# Altium schematic sheet USB_HUB.SchDoc: Dahlia Carrier Board
size A3; Organization: Toradex AG; Address1: Ebenaustrasse 10; Address2: Horw; Address3: 6048; Address4: Switzerland; DocumentNumber: 5; Revision: V1.1; SheetNumber: 5; SheetTotal: 21; PageSetup: Record=PageOptions|CenterHorizontal=True|CenterVertical=True|PrintScale=0.71|XCorrection=1.00|YCorrection=1.00|PrintKind=1|BorderSize=5000000|LeftOffset=0|BottomOffset=0|Orientation=2|PaperLength=1000|PaperWidth=1000|Scale=100|PaperSource=15|PrintQuality=600|MediaType=1|DitherType=10|PaperKind=A4|PrintScaleMode=1
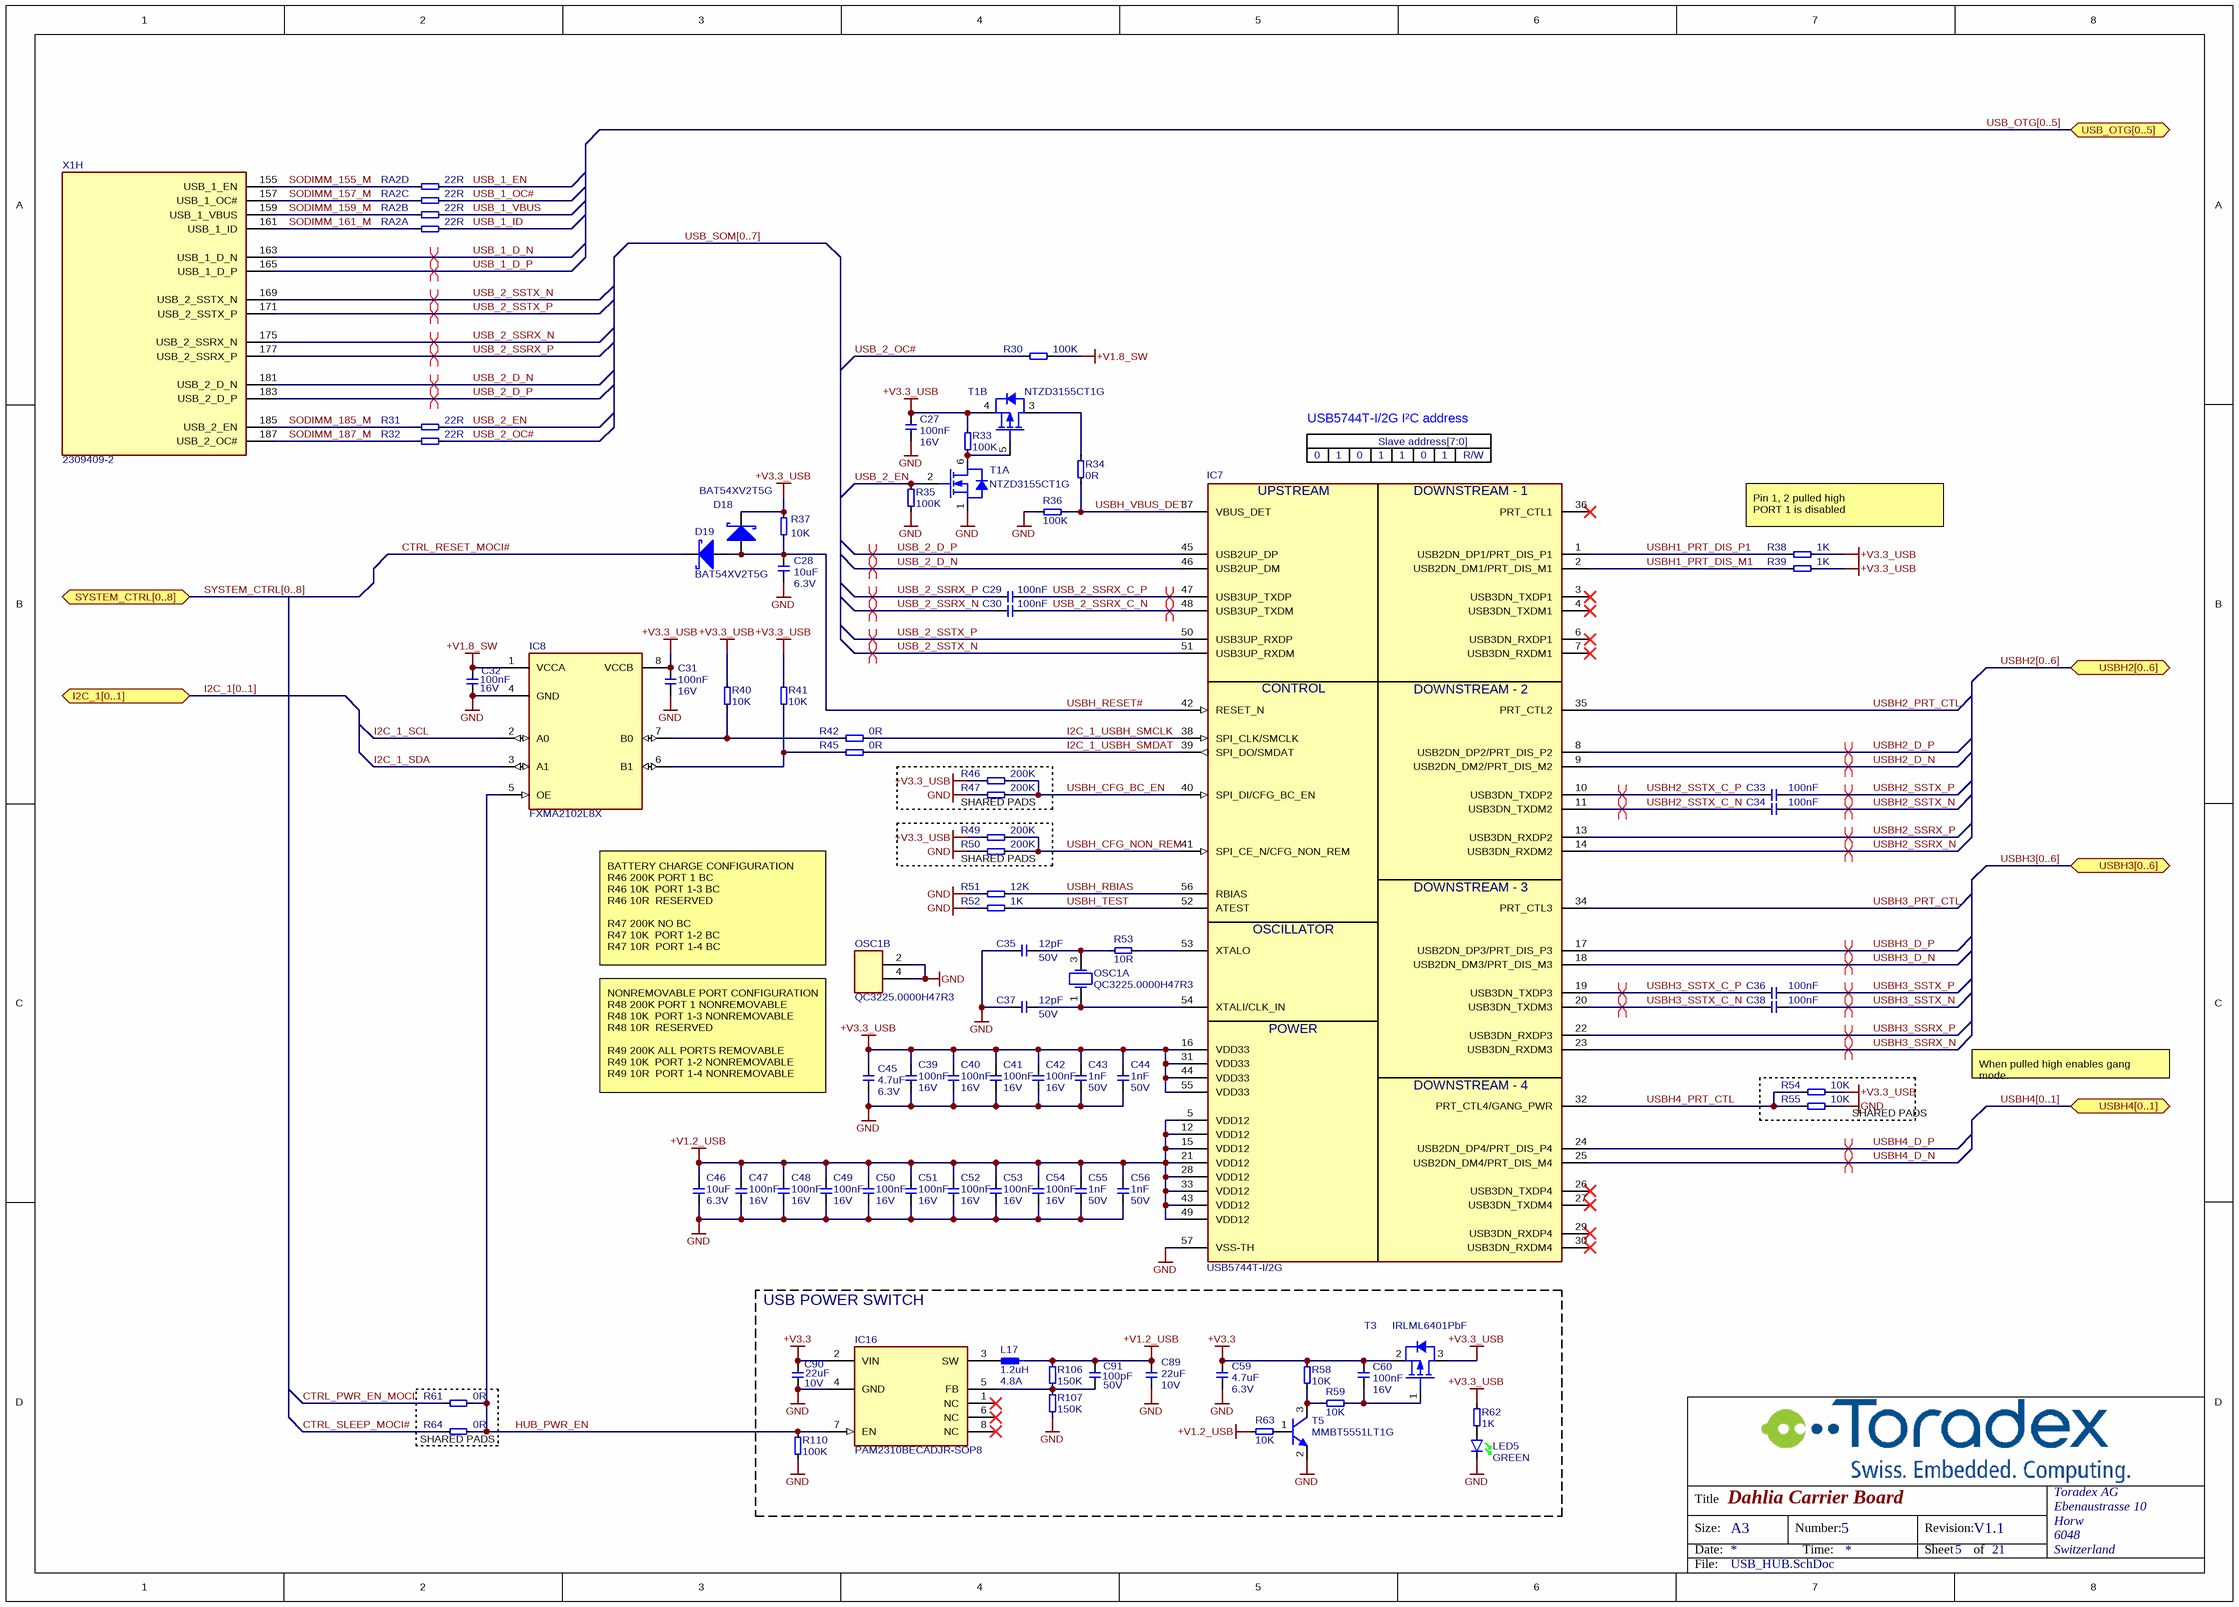
[diagram p0: USB_HUB.SchDoc]

## Parts
C27  Rating: 16V  [CAPC1005X60N]  (hidden comment: 100nF)
C28  Rating: 6.3V  [CAPC1005X60N]  (hidden comment: 10uF)
C29  100nF  [CAPC1005X60N]
C30  100nF  [CAPC1005X60N]
C31  Rating: 16V  [CAPC1005X60N]  (hidden comment: 100nF)
C32  Rating: 16V  [CAPC1005X60N]  (hidden comment: 100nF)
C33  100nF  [CAPC1005X60N]
C34  100nF  [CAPC1005X60N]
C35  Rating: 50V  [CAPC1005X60N]  (hidden comment: 12pF)
C36  100nF  [CAPC1005X60N]
C37  Rating: 50V  [CAPC1005X60N]  (hidden comment: 12pF)
C38  100nF  [CAPC1005X60N]
C39  Rating: 16V  [CAPC1005X60N]  (hidden comment: 100nF)
C40  Rating: 16V  [CAPC1005X60N]  (hidden comment: 100nF)
C41  Rating: 16V  [CAPC1005X60N]  (hidden comment: 100nF)
C42  Rating: 16V  [CAPC1005X60N]  (hidden comment: 100nF)
C43  Rating: 50V  [CAPC1005X60N]  (hidden comment: 1nF)
C44  Rating: 50V  [CAPC1005X60N]  (hidden comment: 1nF)
C45  Rating: 6.3V  [CAPC1005X60N]  (hidden comment: 4.7uF)
C46  Rating: 6.3V  [CAPC1005X60N]  (hidden comment: 10uF)
C47  Rating: 16V  [CAPC1005X60N]  (hidden comment: 100nF)
C48  Rating: 16V  [CAPC1005X60N]  (hidden comment: 100nF)
C49  Rating: 16V  [CAPC1005X60N]  (hidden comment: 100nF)
C50  Rating: 16V  [CAPC1005X60N]  (hidden comment: 100nF)
C51  Rating: 16V  [CAPC1005X60N]  (hidden comment: 100nF)
C52  Rating: 16V  [CAPC1005X60N]  (hidden comment: 100nF)
C53  Rating: 16V  [CAPC1005X60N]  (hidden comment: 100nF)
C54  Rating: 16V  [CAPC1005X60N]  (hidden comment: 100nF)
C55  Rating: 50V  [CAPC1005X60N]  (hidden comment: 1nF)
C56  Rating: 50V  [CAPC1005X60N]  (hidden comment: 1nF)
C59  Rating: 6.3V  [CAPC1005X60N]  (hidden comment: 4.7uF)
C60  Rating: 16V  [CAPC1005X60N]  (hidden comment: 100nF)
C89  Rating: 10V  [T_CAPC0805X125N]  (hidden comment: 22uF)
C90  Rating: 10V  [T_CAPC0805X125N]  (hidden comment: 22uF)
C91  Rating: 50V  [CAPC1005X60N]  (hidden comment: 100pF)
D18  BAT54XV2T5G  [SOD-523]
D19  BAT54XV2T5G  [SOD-523]
IC7  USB5744T-I/2G  [IC-QFN40P700X700X100_HS-57N]
IC8  FXMA2102L8X  [IC-MicroPak50P160X2160X55-8N]
IC16  Manufacturer Part No.: PAM2310BECADJR-SOP8  [IC-SO-8EP]  (hidden comment: PAM2310BECADJR)
L17  Rating: 4.8A  [IND-BOURNS-SRP4020TA]  (hidden comment: 1.2uH)
LED5  Color: GREEN  [T_Liteon_LTST-C190GKT]  (hidden comment: LTST-C190GKT)
OSC1  QC3225.0000H47R3  [OSC-SMD-3.2mmx2.5mm]  (parts A,B of 2)
R30  100K  [RESC1005X40N]
R31  22R  [RESC1005X40N]
R32  22R  [RESC1005X40N]
R33  100K  [RESC1005X40N]
R34  0R  [T_RESC0603X30N]
R35  100K  [RESC1005X40N]
R36  100K  [RESC1005X40N]
R37  10K  [RESC1005X40N]
R38  1K  [RESC1005X40N]
R39  1K  [RESC1005X40N]
R40  10K  [RESC1005X40N]
R41  10K  [RESC1005X40N]
R42  0R  [T_RESC0603X30N]
R45  0R  [T_RESC0603X30N]
R46  200K  [T_RESC0603X30N]
R47  200K  [T_RESC0603X30N]
R49  200K  [T_RESC0603X30N]
R50  200K  [T_RESC0603X30N]
R51  12K  [RESC1005X40N]
R52  1K  [RESC1005X40N]
R53  10R  [RESC1005X40N]
R54  10K  [T_RESC0603X30N]
R55  10K  [T_RESC0603X30N]
R58  10K  [RESC1005X40N]
R59  10K  [RESC1005X40N]
R61  0R  [T_RESC0603X30N]
R62  1K  [RESC1005X40N]
R63  10K  [RESC1005X40N]
R64  0R  [T_RESC0603X30N]
R106  150K  [RESC1005X40N]
R107  150K  [RESC1005X40N]
R110  100K  [RESC1005X40N]
RA2  22R  [T_Resistor_Array_X4]  (parts A,B,C,D of 4)
T1  NTZD3155CT1G  [SOTFL50P160X60-6N]  (parts A,B of 2)
T3  IRLML6401PbF  [SOT95P237X112-3N]
T5  MMBT5551LT1G  [ONSC-SOT-23-3-318-08_V]
X1  2309409-2  [CON-TE-2309409-2-SOLDERABLE-STANDOFFS]  (part H of 23)

## Blocks framed on the sheet
SHARED PADS: R46 R47
SHARED PADS: R54 R55
USB POWER SWITCH: C59 C60 C89-C91 IC16 L17 LED5 R58 R59 R62 R63 R106 R107 R110 T3 T5
SHARED PADS: R61 R64

## Ports
I2C_1[0..1] (bidir), SYSTEM_CTRL[0..8] (bidir), USB_OTG[0..5] (bidir), USBH2[0..6] (bidir), USBH3[0..6] (bidir), USBH4[0..1] (bidir)

## Nets
+V1.2_USB: C46.2 C47.2 C48.2 C49.2 C50.2 C51.2 C52.2 C53.2 C54.2 C55.2 C56.2 C89.2 C91.2 IC7.5(VDD12) IC7.12(VDD12) IC7.15(VDD12) IC7.21(VDD12) IC7.28(VDD12) IC7.33(VDD12) IC7.43(VDD12) IC7.49(VDD12) L17.2 R63.2 R106.2
+V1.8_SW: C32.2 IC8.1(VCCA) R30.2
+V3.3: C59.2 C60.2 C90.2 IC16.2(VIN) R58.2 T3.2(S)
+V3.3_USB: C27.2 C31.2 C39.2 C40.2 C41.2 C42.2 C43.2 C44.2 C45.2 D18.C IC7.16(VDD33) IC7.31(VDD33) IC7.44(VDD33) IC7.55(VDD33) IC8.8(VCCB) R33.2 R37.2 R38.2 R39.2 R40.2 R41.2 R46.1 R49.1 R54.2 R62.2 T1.4(S) T3.3(D)
GND: C27.1 C28.1 C31.1 C32.1 C35.2 C37.2 C39.1 C40.1 C41.1 C42.1 C43.1 C44.1 C45.1 C46.1 C47.1 C48.1 C49.1 C50.1 C51.1 C52.1 C53.1 C54.1 C55.1 C56.1 C59.1 C89.1 C90.1 IC7.57(VSS-TH) IC8.4(GND) IC16.4(GND) LED5.K OSC1.2(OSC2) OSC1.4(OSC3) R35.1 R36.2 R47.1 R50.1 R51.1 R52.1 R55.2 R107.1 R110.1 T1.1(S) T5.2(E)
CTRL_PWR_EN_MOCI: R61.1
CTRL_RESET_MOCI#: D19.C
CTRL_SLEEP_MOCI#: R64.1
HUB_PWR_EN: IC8.5(OE) IC16.7(EN) R61.2 R64.2 R110.2
I2C_1_SCL: IC8.2(A0)
I2C_1_SDA: IC8.3(A1)
I2C_1_USBH_SMCLK: IC7.38(SPI_CLK/SMCLK) R42.2
I2C_1_USBH_SMDAT: IC7.39(SPI_DO/SMDAT) R45.2
SODIMM_155_M: RA2.4 X1.155(USB_1_EN)
SODIMM_157_M: RA2.3 X1.157(USB_1_OC#)
SODIMM_159_M: RA2.2 X1.159(USB_1_VBUS)
SODIMM_161_M: RA2.1 X1.161(USB_1_ID)
SODIMM_185_M: R31.1 X1.185(USB_2_EN)
SODIMM_187_M: R32.1 X1.187(USB_2_OC#)
USB_1_D_N: X1.163(USB_1_D_N)
USB_1_D_P: X1.165(USB_1_D_P)
USB_1_EN: RA2.8
USB_1_ID: RA2.5
USB_1_OC#: RA2.7
USB_1_VBUS: RA2.6
USB_2_D_N: IC7.46(USB2UP_DM) X1.181(USB_2_D_N)
USB_2_D_P: IC7.45(USB2UP_DP) X1.183(USB_2_D_P)
USB_2_EN: R31.2 R35.2 T1.2(G)
USB_2_OC#: R30.1 R32.2
USB_2_SSRX_C_N: C30.1 IC7.48(USB3UP_TXDM)
USB_2_SSRX_C_P: C29.1 IC7.47(USB3UP_TXDP)
USB_2_SSRX_N: C30.2 X1.175(USB_2_SSRX_N)
USB_2_SSRX_P: C29.2 X1.177(USB_2_SSRX_P)
USB_2_SSTX_N: IC7.51(USB3UP_RXDM) X1.169(USB_2_SSTX_N)
USB_2_SSTX_P: IC7.50(USB3UP_RXDP) X1.171(USB_2_SSTX_P)
USBH1_PRT_DIS_M1: IC7.2(USB2DN_DM1/PRT_DIS_M1) R39.1
USBH1_PRT_DIS_P1: IC7.1(USB2DN_DP1/PRT_DIS_P1) R38.1
USBH2_D_N: IC7.9(USB2DN_DM2/PRT_DIS_M2)
USBH2_D_P: IC7.8(USB2DN_DP2/PRT_DIS_P2)
USBH2_PRT_CTL: IC7.35(PRT_CTL2)
USBH2_SSRX_N: IC7.14(USB3DN_RXDM2)
USBH2_SSRX_P: IC7.13(USB3DN_RXDP2)
USBH2_SSTX_C_N: C34.2 IC7.11(USB3DN_TXDM2)
USBH2_SSTX_C_P: C33.2 IC7.10(USB3DN_TXDP2)
USBH2_SSTX_N: C34.1
USBH2_SSTX_P: C33.1
USBH3_D_N: IC7.18(USB2DN_DM3/PRT_DIS_M3)
USBH3_D_P: IC7.17(USB2DN_DP3/PRT_DIS_P3)
USBH3_PRT_CTL: IC7.34(PRT_CTL3)
USBH3_SSRX_N: IC7.23(USB3DN_RXDM3)
USBH3_SSRX_P: IC7.22(USB3DN_RXDP3)
USBH3_SSTX_C_N: C38.2 IC7.20(USB3DN_TXDM3)
USBH3_SSTX_C_P: C36.2 IC7.19(USB3DN_TXDP3)
USBH3_SSTX_N: C38.1
USBH3_SSTX_P: C36.1
USBH4_D_N: IC7.25(USB2DN_DM4/PRT_DIS_M4)
USBH4_D_P: IC7.24(USB2DN_DP4/PRT_DIS_P4)
USBH4_PRT_CTL: IC7.32(PRT_CTL4/GANG_PWR) R54.1 R55.1
USBH_CFG_BC_EN: IC7.40(SPI_DI/CFG_BC_EN) R46.2 R47.2
USBH_CFG_NON_REM: IC7.41(SPI_CE_N/CFG_NON_REM) R49.2 R50.2
USBH_RBIAS: IC7.56(RBIAS) R51.2
USBH_RESET#: C28.2 D18.A D19.A IC7.42(RESET_N) R37.1
USBH_TEST: IC7.52(ATEST) R52.2
USBH_VBUS_DET: IC7.37(VBUS_DET) R34.2 R36.1
NetC35_1: C35.1 OSC1.3(OSC2) R53.1
NetC37_1: C37.1 IC7.54(XTALI/CLK_IN) OSC1.1(OSC1)
NetC60_1: C60.1 R59.1 T3.1(G)
NetC91_1: C91.1 IC16.5(FB) R106.1 R107.2
NetIC7_53: IC7.53(XTALO) R53.2
NetIC8_6: IC8.6(B1) R41.1 R45.1
NetIC8_7: IC8.7(B0) R40.1 R42.1
NetIC16_3: IC16.3(SW) L17.1
NetLED5_A: LED5.A R62.1
NetR33_1: R33.1 T1.5(G) T1.6(D)
NetR34_1: R34.1 T1.3(D)
NetR58_1: R58.1 R59.2 T5.3(C)
NetR63_1: R63.1 T5.1(B)

Not connected (* = marked no-connect by the designer): IC7 3(USB3DN_TXDP1)* 4(USB3DN_TXDM1)* 6(USB3DN_RXDP1)* 7(USB3DN_RXDM1)* 26(USB3DN_TXDP4)* 27(USB3DN_TXDM4)* 29(USB3DN_RXDP4)* 30(USB3DN_RXDM4)* 36(PRT_CTL1)*; IC16 1(NC)* 6(NC)* 8(NC)*

## Buses and harness runs
bus I2C_1[0..1] = port I2C_1[0..1]
bus SYSTEM_CTRL[0..8] = port SYSTEM_CTRL[0..8]
bus USB_OTG[0..5] = port USB_OTG[0..5]
bus USB_SOM[0..7]
bus USBH2[0..6] = port USBH2[0..6]
bus USBH3[0..6] = port USBH3[0..6]
bus USBH4[0..1] = port USBH4[0..1]

## Layout directives
differential pair; differential pair class USB: USB_1_D_N, USB_1_D_P, USB_2_D_N, USB_2_D_P, USB_2_SSRX_C_N, USB_2_SSRX_C_P, USB_2_SSRX_N, USB_2_SSRX_P, USB_2_SSTX_N, USB_2_SSTX_P, USBH2_D_N, USBH2_D_P, USBH2_SSRX_N, USBH2_SSRX_P, USBH2_SSTX_C_N, USBH2_SSTX_C_P, USBH2_SSTX_N, USBH2_SSTX_P, USBH3_D_N, USBH3_D_P, USBH3_SSRX_N, USBH3_SSRX_P, USBH3_SSTX_C_N, USBH3_SSTX_C_P, USBH3_SSTX_N, USBH3_SSTX_P, USBH4_D_N, USBH4_D_P

## Notes on the sheet
- USB5744T-I/2G I²C address
- (near IC7) 0
- (near IC7) 1
- Slave address[7:0]
- (near IC7) R/W
- Pin 1, 2 pulled high
  PORT 1 is disabled
- (near R50) SHARED PADS
- BATTERY CHARGE CONFIGURATION
  R46 200K PORT 1 BC
  R46 10K  PORT 1-3 BC
  R46 10R  RESERVED
  R47 200K NO BC
  R47 10K  PORT 1-2 BC
  R47 10R  PORT 1-4 BC
- NONREMOVABLE PORT CONFIGURATION
  R48 200K PORT 1 NONREMOVABLE
  R48 10K  PORT 1-3 NONREMOVABLE
  R48 10R  RESERVED
  R49 200K ALL PORTS REMOVABLE
  R49 10K  PORT 1-2 NONREMOVABLE
  R49 10R  PORT 1-4 NONREMOVABLE
- When pulled high enables gang mode.
- Title
- Size:
- Date:
- A3
- Number:
- Time:
- Revision:
- Sheet
- of
- File:
- (in symbol IC-Microchip-USB5744T-I/2G) UPSTREAM; DOWNSTREAM - 1; CONTROL; DOWNSTREAM - 2; DOWNSTREAM - 3; OSCILLATOR; POWER; DOWNSTREAM - 4

## Library data of the parts
C27 C29-C34 C36 C38-C42 C47-C54 C60 = C-X7R-100nF-16V-10%-0402: Capacitor Ceramic X7R 100nF 16V 10% 0402; Tolerance: 10%; Type: X7R; Value: 100nF
  C29 C30 C33 C34 C36 C38: Rating: 16V
C28 C46 = C-X5R-10u-6.3V-20%-0402: Capacitor Ceramic X5R 10uF 6.3V 20% 0402; Tolerance: 20%; Type: X5R; Value: 10uF
C35 C37 = C-NP0-12p-50V-5%-0402: Capacitor Ceramic NP0  12pF 50V 5% 0402; Tolerance: 5%; Type: NP0; Value: 12pF
C43 C44 C55 C56 = C-X7R-1nF-50V-10%-0402: Capacitor Ceramic X7R 1nF 50V 10% 0402; Tolerance: 10%; Type: X7R; Value: 1nF
C45 C59 = C-X5R-4.7u-6.3V-20%-0402: Capacitor Ceramic X5R 4.7uF 6.3V 20% 0402; Tolerance: 20%; Type: X5R; Value: 4.7uF
C89 C90 = C-X5R-22uF-10V-20%-0805: Capacitor Ceramic X5R 22uF 10V 20% 0805; Tolerance: 20%; Type: X5R; Value: 22uF; ClassName: Power_Poly
C91 = C-X7R-100pF-50V-10%-0402: Capacitor Ceramic X7R 100pF 50V 10% 0402; Tolerance: 10%; Type: X7R; Value: 100pF
D18 D19 = D-BAT54-SOD523: Schottky Barrier Rectifier; Manufacturer Name: On Semi; Manufacturer Part No.: BAT54XV2T5G
IC7 = IC-Microchip-USB5744T-I/2G: 4-Port SS/HS USB 3.0 Controller Hub, VQFN-56, -40C to +85C; Manufacturer Name: Microchip; Temperature Range: -40C to +85C; Package: QFN-56, Leadless (7mm x 7mm); Manufacturer Part No.: USB5744T-I/2G
IC8 = IC-ONsemi-FXMA2102L8X: Voltage Level Translator for I2C Applications; Manufacturer Name: ONSemi; Manufacturer Part No.: FXMA2102L8X
IC16 = IC-DIODES-PAM2310BECADJR-SOP8: Integrated Buck Regulator; Manufacturer Name: Diodes
L17 = L-Bourns-SRP4020TA-1R2M-1.2uH-4.8A-20%: 1.2µH Shielded Wirewound Inductor 4.8A 30mOhm; Manufacturer Name: Bourns; Tolerance: 20%; I (saturation): 7.8A; Manufacturer Part No.: SRP4020TA-1R2M; I (RMS): 4.8A; Value: 1.2uH; ClassName: Power_Poly
LED5 = LED-LiteOn-LTST-C190GKT: LED green Lite-ON LTST-C190GKT; Manufacturer Name: Lite-ON; Manufacturer Part No.: LTST-C190GKT
OSC1 = OSC-Qantek-QC3225.0000H47R3: 25MHz Crystal Oscillator, Qantek QC3225.0000H47R3, 20ppm, -40C to +85C, 10pF; Tolerance: +/- 20 ppm; Manufacturer Name: QANTEK; Package: 3.2mm X 2.5mm; Temperature Range: -40C to +85C; Value: 25 MHz; Manufacturer Part No.: QC3225.0000H47R3
R30 R33 R35 R36 R110 = R-100K-63mW-5%-0402: Resistor 100 Kohm 63mW 5% 0402; Rating: 63mW; Tolerance: 5%; Value: 100K
R31 R32 = R-22R-63mW-5%-0402: Resistor 22 ohm 63mW 5% 0402; Rating: 63mW; Tolerance: 5%; Value: 22R
R34 R42 R45 R61 R64 = R-0R-63mW-1%-0603: Resistor 0 ohm 63mW 1% 0603; Rating: 63mW; Tolerance: 1%; Value: 0R
R37 R40 R41 R58 R59 R63 = R-10K-63mW-5%-0402: Resistor 10 Kohm 63mW 5% 0402; Rating: 63mW; Tolerance: 5%; Value: 10K
R38 R39 R52 R62 = R-1K-63mW-5%-0402: Resistor 1 Kohm 63mW 5% 0402; Rating: 63mW; Tolerance: 5%; Value: 1K
R46 R47 R49 R50 = R-200K-63mW-5%-0603: Resistor 200 Kohm 63mW 5% 0603; Rating: 63mW; Tolerance: 5%; Value: 200K
R51 = R-12K-63mW-1%-0402: Resistor 12 Kohm 63mW 1% 0402; Rating: 63mW; Tolerance: 1%; Value: 12K
R53 = R-10R-63mW-5%-0402: Resistor 10 ohm 63mW 5% 0402; Rating: 63mW; Tolerance: 5%; Value: 10R
R54 R55 = R-10K-63mW-5%-0603: Resistor 10 Kohm 63mW 5% 0603; Rating: 63mW; Tolerance: 5%; Value: 10K
R106 R107 = R-150K-63mW-1%-0402: Resistor 150 Kohm 63mW 1% 0402; Value: 150KR; Rating: 63mW; Tolerance: 1%
RA2 = RA-22R-63mW-5%-1206-div: Resistor Array 22 R 63mW 5% 1206; Tolerance: 5%; Power Dissipation: 63mW; Value: 22R
T1 = T-ONSemi-NTZD3155CT1G: N- and P-Channel MOSFET 20V; Manufacturer Name: ONSemi; Manufacturer Part No.: NTZD3155CT1G
T3 = T-IR-IRLML6401PbF-SOT-23: p-channel MOSFET, IRLML6401PbF; Manufacturer Name: International Rectifier; Manufacturer Part No.: IRLML6401PbF
T5 = T-ONSemi-MMBT5551LT1G -SOT-23: Bipolar Transistor NPN 160V 600mA  225mW Surface Mount SOT-23-3; Manufacturer Name: ONSemi; Manufacturer Part No.: MMBT5551LT1G
X1 = CON-TE-2309409-2: DDR4 SODIMM Socket, 260 pins, 5.2mm(H), 0.5mm Pitch; Manufacturer Name: TE; Temperature Range: -40C to +125C; Package: DDR4-SODIMM-260; Manufacturer Part No.: 2309409-2